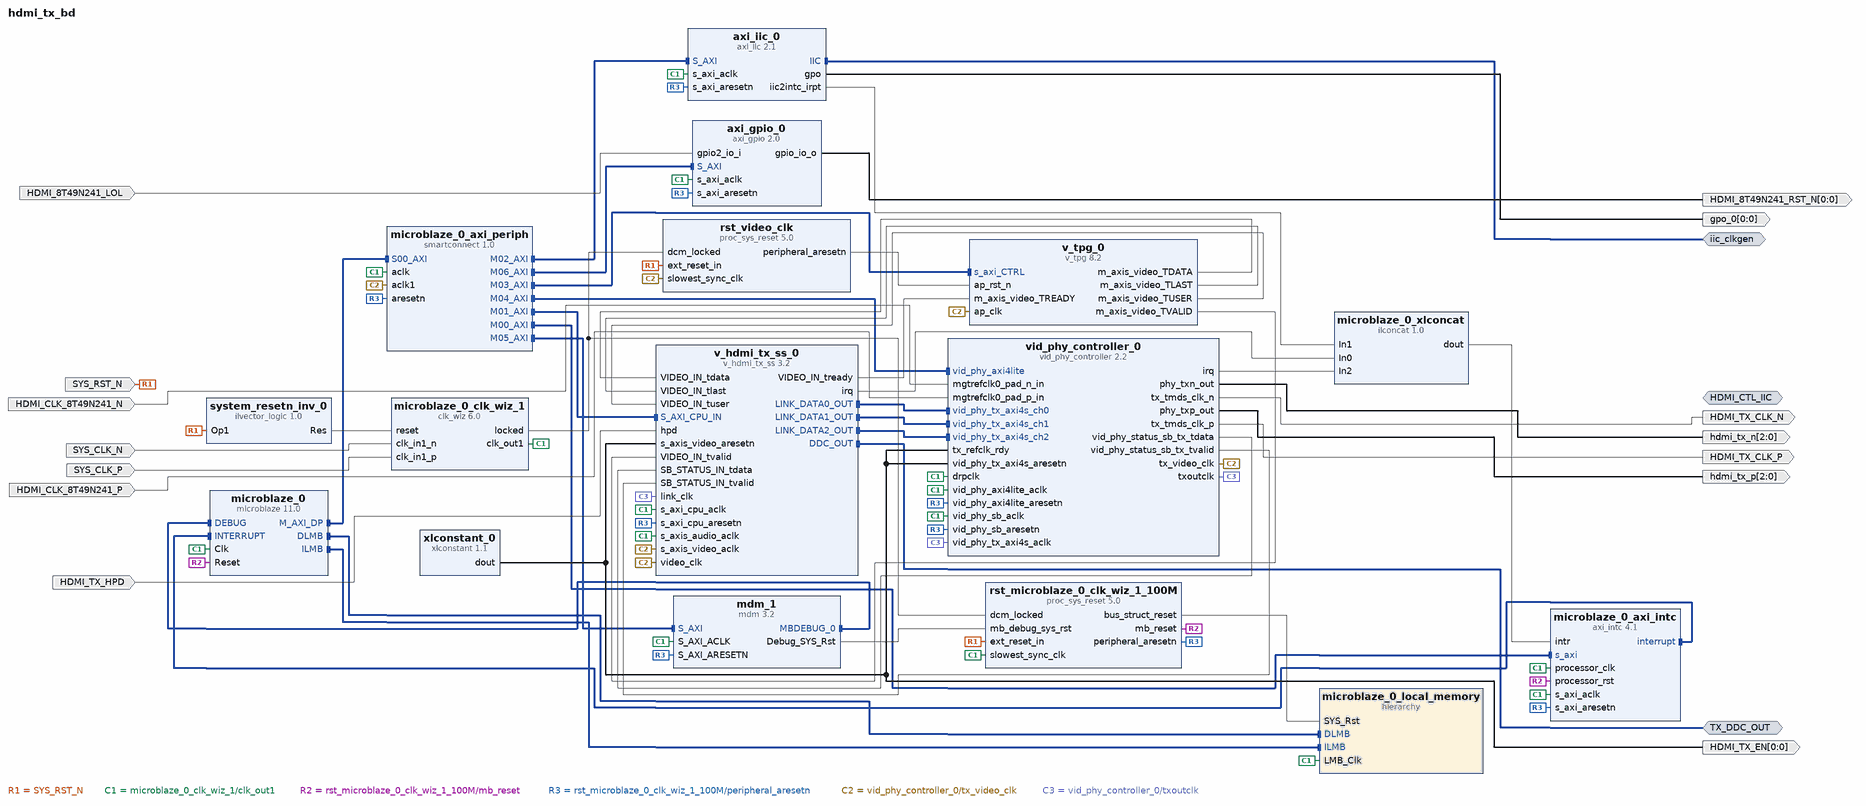
[diagram p0: block diagram of the top level]
# Vivado block design hdmi_tx_bd, xcau15p-ffvb676-2-e, Vivado 2025.2
create_bd_design hdmi_tx_bd

create_bd_intf_port -mode Master -vlnv xilinx.com:interface:iic_rtl:1.0 iic_clkgen
create_bd_intf_port -mode Master -vlnv xilinx.com:interface:iic_rtl:1.0 HDMI_CTL_IIC
create_bd_intf_port -mode Master -vlnv xilinx.com:interface:iic_rtl:1.0 TX_DDC_OUT
create_bd_port -dir I SYS_CLK_N
create_bd_port -dir I SYS_CLK_P
create_bd_port -dir I SYS_RST_N
create_bd_port -dir O -from 0 -to 0 gpo_0
create_bd_port -dir I HDMI_CLK_8T49N241_P
create_bd_port -dir I HDMI_CLK_8T49N241_N
create_bd_port -dir O -from 2 -to 0 hdmi_tx_p
create_bd_port -dir O -from 2 -to 0 hdmi_tx_n
create_bd_port -dir O -from 0 -to 0 HDMI_TX_EN
create_bd_port -dir I HDMI_TX_HPD
create_bd_port -dir O HDMI_TX_CLK_P
create_bd_port -dir O HDMI_TX_CLK_N
create_bd_port -dir O -from 0 -to 0 HDMI_8T49N241_RST_N
create_bd_port -dir I HDMI_8T49N241_LOL

create_bd_cell -type ip -vlnv xilinx.com:ip:v_hdmi_tx_ss:3.2 v_hdmi_tx_ss_0
set_property -dict {CONFIG.C_EXDES_TOPOLOGY 1 CONFIG.C_INPUT_PIXELS_PER_CLOCK 4} [get_bd_cells v_hdmi_tx_ss_0]
create_bd_cell -type ip -vlnv xilinx.com:ip:v_tpg:8.2 v_tpg_0
set_property -dict [list \
  CONFIG.HAS_AXI4S_SLAVE 0 \
  CONFIG.MAX_COLS 1920 \
  CONFIG.MAX_ROWS 1080 \
  CONFIG.SAMPLES_PER_CLOCK 4 \
] [get_bd_cells v_tpg_0]
create_bd_cell -type ip -vlnv xilinx.com:ip:smartconnect:1.0 microblaze_0_axi_periph
set_property -dict {CONFIG.NUM_CLKS 2 CONFIG.NUM_MI 7 CONFIG.NUM_SI 1} [get_bd_cells microblaze_0_axi_periph]
create_bd_cell -type ip -vlnv xilinx.com:ip:axi_intc:4.1 microblaze_0_axi_intc
set_property -dict {CONFIG.C_HAS_FAST 1 CONFIG.C_NUM_SW_INTR 3} [get_bd_cells microblaze_0_axi_intc]
create_bd_cell -type inline_hdl -vlnv xilinx.com:inline_hdl:ilconcat:1.0 microblaze_0_xlconcat
set_property -dict {CONFIG.NUM_PORTS 3} [get_bd_cells microblaze_0_xlconcat]
create_bd_cell -type ip -vlnv xilinx.com:ip:mdm:3.2 mdm_1
set_property -dict {CONFIG.C_ADDR_SIZE 32 CONFIG.C_M_AXI_ADDR_WIDTH 32 CONFIG.C_USE_UART 1} [get_bd_cells mdm_1]
create_bd_cell -type ip -vlnv xilinx.com:ip:clk_wiz:6.0 microblaze_0_clk_wiz_1
set_property -dict [list \
  CONFIG.CLKIN1_JITTER_PS 33.330000000000005 \
  CONFIG.CLKOUT1_JITTER 101.475 \
  CONFIG.CLKOUT1_PHASE_ERROR 77.836 \
  CONFIG.MMCM_CLKFBOUT_MULT_F 4.000 \
  CONFIG.MMCM_CLKIN1_PERIOD 3.333 \
  CONFIG.MMCM_CLKIN2_PERIOD 10.0 \
  CONFIG.PRIM_IN_FREQ 300.000 \
  CONFIG.PRIM_SOURCE Differential_clock_capable_pin \
] [get_bd_cells microblaze_0_clk_wiz_1]
create_bd_cell -type ip -vlnv xilinx.com:ip:proc_sys_reset:5.0 rst_microblaze_0_clk_wiz_1_100M
create_bd_cell -type inline_hdl -vlnv xilinx.com:inline_hdl:ilvector_logic:1.0 system_resetn_inv_0
set_property -dict {CONFIG.C_OPERATION not CONFIG.C_SIZE 1} [get_bd_cells system_resetn_inv_0]
create_bd_cell -type ip -vlnv xilinx.com:ip:axi_iic:2.1 axi_iic_0
create_bd_cell -type ip -vlnv xilinx.com:ip:vid_phy_controller:2.2 vid_phy_controller_0
set_property -dict [list \
  CONFIG.Adv_Clk_Mode false \
  CONFIG.CHANNEL_SITE X0Y8 \
  CONFIG.C_RX_PLL_SELECTION 0 \
  CONFIG.C_RX_REFCLK_SEL 1 \
  CONFIG.C_Rx_Protocol None \
  CONFIG.C_TX_PLL_SELECTION 6 \
  CONFIG.C_TX_REFCLK_SEL 0 \
  CONFIG.C_Tx_Protocol HDMI \
] [get_bd_cells vid_phy_controller_0]
create_bd_cell -type ip -vlnv xilinx.com:ip:proc_sys_reset:5.0 rst_video_clk
create_bd_cell -type ip -vlnv xilinx.com:ip:microblaze:11.0 microblaze_0
set_property -dict [list \
  CONFIG.C_DEBUG_ENABLED 1 \
  CONFIG.C_D_AXI 1 \
  CONFIG.C_D_LMB 1 \
  CONFIG.C_ENABLE_CONVERSION 0 \
  CONFIG.C_I_LMB 1 \
  CONFIG.G_TEMPLATE_LIST 8 \
] [get_bd_cells microblaze_0]
create_bd_cell -type hier microblaze_0_local_memory
create_bd_cell -type ip -vlnv xilinx.com:ip:axi_gpio:2.0 axi_gpio_0
set_property -dict [list \
  CONFIG.C_ALL_INPUTS 0 \
  CONFIG.C_ALL_INPUTS_2 1 \
  CONFIG.C_ALL_OUTPUTS 1 \
  CONFIG.C_GPIO2_WIDTH 1 \
  CONFIG.C_GPIO_WIDTH 1 \
  CONFIG.C_IS_DUAL 1 \
] [get_bd_cells axi_gpio_0]
create_bd_cell -type ip -vlnv xilinx.com:ip:xlconstant:1.1 xlconstant_0

# ---- hierarchy /microblaze_0_local_memory ----
current_bd_instance /microblaze_0_local_memory
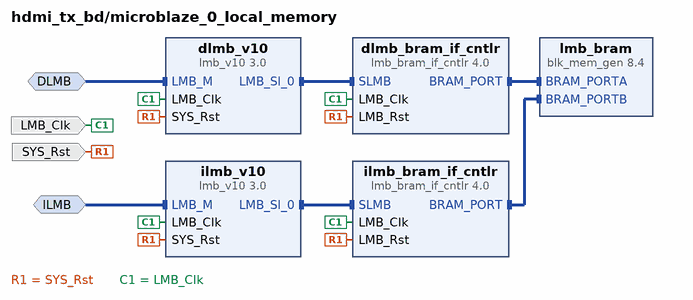
[diagram p1: block diagram inside /microblaze_0_local_memory]
create_bd_intf_pin -mode MirroredMaster -vlnv xilinx.com:interface:lmb_rtl:1.0 DLMB
create_bd_intf_pin -mode MirroredMaster -vlnv xilinx.com:interface:lmb_rtl:1.0 ILMB
create_bd_pin -dir I -type clk LMB_Clk
create_bd_pin -dir I -type rst SYS_Rst

create_bd_cell -type ip -vlnv xilinx.com:ip:lmb_v10:3.0 dlmb_v10
create_bd_cell -type ip -vlnv xilinx.com:ip:lmb_v10:3.0 ilmb_v10
create_bd_cell -type ip -vlnv xilinx.com:ip:lmb_bram_if_cntlr:4.0 dlmb_bram_if_cntlr
set_property -dict {CONFIG.C_ECC 0} [get_bd_cells dlmb_bram_if_cntlr]
create_bd_cell -type ip -vlnv xilinx.com:ip:lmb_bram_if_cntlr:4.0 ilmb_bram_if_cntlr
set_property -dict {CONFIG.C_ECC 0} [get_bd_cells ilmb_bram_if_cntlr]
create_bd_cell -type ip -vlnv xilinx.com:ip:blk_mem_gen:8.4 lmb_bram
set_property -dict {CONFIG.Memory_Type True_Dual_Port_RAM CONFIG.use_bram_block BRAM_Controller} [get_bd_cells lmb_bram]

# ---- connections ----

current_bd_instance /microblaze_0_local_memory
connect_bd_intf_net -intf_net microblaze_0_dlmb [get_bd_intf_pins dlmb_v10/LMB_M] [get_bd_intf_pins DLMB]
connect_bd_intf_net -intf_net microblaze_0_dlmb_bus [get_bd_intf_pins dlmb_v10/LMB_Sl_0] [get_bd_intf_pins dlmb_bram_if_cntlr/SLMB]
connect_bd_intf_net -intf_net microblaze_0_dlmb_cntlr [get_bd_intf_pins dlmb_bram_if_cntlr/BRAM_PORT] [get_bd_intf_pins lmb_bram/BRAM_PORTA]
connect_bd_intf_net -intf_net microblaze_0_ilmb [get_bd_intf_pins ilmb_v10/LMB_M] [get_bd_intf_pins ILMB]
connect_bd_intf_net -intf_net microblaze_0_ilmb_bus [get_bd_intf_pins ilmb_v10/LMB_Sl_0] [get_bd_intf_pins ilmb_bram_if_cntlr/SLMB]
connect_bd_intf_net -intf_net microblaze_0_ilmb_cntlr [get_bd_intf_pins ilmb_bram_if_cntlr/BRAM_PORT] [get_bd_intf_pins lmb_bram/BRAM_PORTB]
connect_bd_net [get_bd_pins SYS_Rst] \
  [get_bd_pins dlmb_v10/SYS_Rst] [get_bd_pins dlmb_bram_if_cntlr/LMB_Rst] [get_bd_pins ilmb_v10/SYS_Rst] \
  [get_bd_pins ilmb_bram_if_cntlr/LMB_Rst]
connect_bd_net -net microblaze_0_Clk [get_bd_pins LMB_Clk] \
  [get_bd_pins dlmb_v10/LMB_Clk] [get_bd_pins dlmb_bram_if_cntlr/LMB_Clk] [get_bd_pins ilmb_v10/LMB_Clk] \
  [get_bd_pins ilmb_bram_if_cntlr/LMB_Clk]
set_property HDL_ATTRIBUTE.BMM_INFO_ADDRESS_SPACE {byte  0x00000000 32 > hdmi_tx_bd microblaze_0_local_memory/lmb_bram} [get_bd_cells dlmb_bram_if_cntlr]
set_property HDL_ATTRIBUTE.KEEP_HIERARCHY yes [get_bd_cells dlmb_bram_if_cntlr]

current_bd_instance /
connect_bd_intf_net [get_bd_intf_ports iic_clkgen] [get_bd_intf_pins axi_iic_0/IIC]
connect_bd_intf_net -intf_net microblaze_0_axi_dp [get_bd_intf_pins microblaze_0_axi_periph/S00_AXI] [get_bd_intf_pins microblaze_0/M_AXI_DP]
connect_bd_intf_net [get_bd_intf_pins microblaze_0_axi_periph/M01_AXI] [get_bd_intf_pins v_hdmi_tx_ss_0/S_AXI_CPU_IN]
connect_bd_intf_net [get_bd_intf_pins microblaze_0_axi_periph/M02_AXI] [get_bd_intf_pins axi_iic_0/S_AXI]
connect_bd_intf_net [get_bd_intf_pins microblaze_0_axi_periph/M03_AXI] [get_bd_intf_pins v_tpg_0/s_axi_CTRL]
connect_bd_intf_net [get_bd_intf_pins microblaze_0_axi_periph/M04_AXI] [get_bd_intf_pins vid_phy_controller_0/vid_phy_axi4lite]
connect_bd_intf_net [get_bd_intf_pins microblaze_0_axi_periph/M05_AXI] [get_bd_intf_pins mdm_1/S_AXI]
connect_bd_intf_net [get_bd_intf_pins microblaze_0_axi_periph/M06_AXI] [get_bd_intf_pins axi_gpio_0/S_AXI]
connect_bd_intf_net [get_bd_intf_pins mdm_1/MBDEBUG_0] [get_bd_intf_pins microblaze_0/DEBUG]
connect_bd_intf_net [get_bd_intf_pins microblaze_0/DLMB] [get_bd_intf_pins microblaze_0_local_memory/DLMB]
connect_bd_intf_net [get_bd_intf_pins microblaze_0/ILMB] [get_bd_intf_pins microblaze_0_local_memory/ILMB]
connect_bd_intf_net -intf_net microblaze_0_intc_axi [get_bd_intf_pins microblaze_0_axi_periph/M00_AXI] [get_bd_intf_pins microblaze_0_axi_intc/s_axi]
connect_bd_intf_net [get_bd_intf_pins microblaze_0_axi_intc/interrupt] [get_bd_intf_pins microblaze_0/INTERRUPT]
connect_bd_intf_net [get_bd_intf_ports TX_DDC_OUT] [get_bd_intf_pins v_hdmi_tx_ss_0/DDC_OUT]
connect_bd_intf_net [get_bd_intf_pins v_hdmi_tx_ss_0/LINK_DATA0_OUT] [get_bd_intf_pins vid_phy_controller_0/vid_phy_tx_axi4s_ch0]
connect_bd_intf_net [get_bd_intf_pins v_hdmi_tx_ss_0/LINK_DATA1_OUT] [get_bd_intf_pins vid_phy_controller_0/vid_phy_tx_axi4s_ch1]
connect_bd_intf_net [get_bd_intf_pins v_hdmi_tx_ss_0/LINK_DATA2_OUT] [get_bd_intf_pins vid_phy_controller_0/vid_phy_tx_axi4s_ch2]
connect_bd_net [get_bd_ports HDMI_8T49N241_LOL] [get_bd_pins axi_gpio_0/gpio2_io_i]
connect_bd_net [get_bd_ports HDMI_CLK_8T49N241_N] [get_bd_pins vid_phy_controller_0/mgtrefclk0_pad_n_in]
connect_bd_net [get_bd_ports HDMI_CLK_8T49N241_P] [get_bd_pins vid_phy_controller_0/mgtrefclk0_pad_p_in]
connect_bd_net [get_bd_ports HDMI_TX_HPD] [get_bd_pins v_hdmi_tx_ss_0/hpd]
connect_bd_net [get_bd_ports SYS_CLK_N] [get_bd_pins microblaze_0_clk_wiz_1/clk_in1_n]
connect_bd_net [get_bd_ports SYS_CLK_P] [get_bd_pins microblaze_0_clk_wiz_1/clk_in1_p]
connect_bd_net [get_bd_ports SYS_RST_N] \
  [get_bd_pins system_resetn_inv_0/Op1] [get_bd_pins rst_video_clk/ext_reset_in] \
  [get_bd_pins rst_microblaze_0_clk_wiz_1_100M/ext_reset_in]
connect_bd_net [get_bd_pins axi_gpio_0/gpio_io_o] [get_bd_ports HDMI_8T49N241_RST_N]
connect_bd_net [get_bd_pins axi_iic_0/gpo] [get_bd_ports gpo_0]
connect_bd_net [get_bd_pins axi_iic_0/iic2intc_irpt] [get_bd_pins microblaze_0_xlconcat/In1]
connect_bd_net [get_bd_pins mdm_1/Debug_SYS_Rst] [get_bd_pins rst_microblaze_0_clk_wiz_1_100M/mb_debug_sys_rst]
connect_bd_net -net microblaze_0_Clk [get_bd_pins microblaze_0_clk_wiz_1/clk_out1] \
  [get_bd_pins vid_phy_controller_0/drpclk] [get_bd_pins vid_phy_controller_0/vid_phy_axi4lite_aclk] \
  [get_bd_pins vid_phy_controller_0/vid_phy_sb_aclk] [get_bd_pins microblaze_0/Clk] \
  [get_bd_pins microblaze_0_axi_periph/aclk] [get_bd_pins microblaze_0_axi_intc/s_axi_aclk] \
  [get_bd_pins microblaze_0_axi_intc/processor_clk] [get_bd_pins microblaze_0_local_memory/LMB_Clk] \
  [get_bd_pins axi_iic_0/s_axi_aclk] [get_bd_pins rst_microblaze_0_clk_wiz_1_100M/slowest_sync_clk] \
  [get_bd_pins v_hdmi_tx_ss_0/s_axi_cpu_aclk] [get_bd_pins v_hdmi_tx_ss_0/s_axis_audio_aclk] [get_bd_pins mdm_1/S_AXI_ACLK] \
  [get_bd_pins axi_gpio_0/s_axi_aclk]
connect_bd_net [get_bd_pins microblaze_0_clk_wiz_1/locked] \
  [get_bd_pins rst_video_clk/dcm_locked] [get_bd_pins rst_microblaze_0_clk_wiz_1_100M/dcm_locked]
connect_bd_net -net microblaze_0_intr [get_bd_pins microblaze_0_xlconcat/dout] [get_bd_pins microblaze_0_axi_intc/intr]
connect_bd_net [get_bd_pins rst_microblaze_0_clk_wiz_1_100M/bus_struct_reset] [get_bd_pins microblaze_0_local_memory/SYS_Rst]
connect_bd_net [get_bd_pins rst_microblaze_0_clk_wiz_1_100M/mb_reset] \
  [get_bd_pins microblaze_0_axi_intc/processor_rst] [get_bd_pins microblaze_0/Reset]
connect_bd_net [get_bd_pins rst_microblaze_0_clk_wiz_1_100M/peripheral_aresetn] \
  [get_bd_pins microblaze_0_axi_periph/aresetn] [get_bd_pins microblaze_0_axi_intc/s_axi_aresetn] \
  [get_bd_pins vid_phy_controller_0/vid_phy_axi4lite_aresetn] [get_bd_pins axi_iic_0/s_axi_aresetn] \
  [get_bd_pins v_hdmi_tx_ss_0/s_axi_cpu_aresetn] [get_bd_pins mdm_1/S_AXI_ARESETN] [get_bd_pins axi_gpio_0/s_axi_aresetn] \
  [get_bd_pins vid_phy_controller_0/vid_phy_sb_aresetn]
connect_bd_net [get_bd_pins rst_video_clk/peripheral_aresetn] [get_bd_pins v_tpg_0/ap_rst_n]
connect_bd_net [get_bd_pins system_resetn_inv_0/Res] [get_bd_pins microblaze_0_clk_wiz_1/reset]
connect_bd_net [get_bd_pins v_hdmi_tx_ss_0/VIDEO_IN_tready] [get_bd_pins v_tpg_0/m_axis_video_TREADY]
connect_bd_net [get_bd_pins v_hdmi_tx_ss_0/irq] [get_bd_pins microblaze_0_xlconcat/In0]
connect_bd_net [get_bd_pins v_tpg_0/m_axis_video_TDATA] [get_bd_pins v_hdmi_tx_ss_0/VIDEO_IN_tdata]
connect_bd_net [get_bd_pins v_tpg_0/m_axis_video_TLAST] [get_bd_pins v_hdmi_tx_ss_0/VIDEO_IN_tlast]
connect_bd_net [get_bd_pins v_tpg_0/m_axis_video_TUSER] [get_bd_pins v_hdmi_tx_ss_0/VIDEO_IN_tuser]
connect_bd_net [get_bd_pins v_tpg_0/m_axis_video_TVALID] [get_bd_pins v_hdmi_tx_ss_0/VIDEO_IN_tvalid]
connect_bd_net [get_bd_pins vid_phy_controller_0/irq] [get_bd_pins microblaze_0_xlconcat/In2]
connect_bd_net [get_bd_pins vid_phy_controller_0/phy_txn_out] [get_bd_ports hdmi_tx_n]
connect_bd_net [get_bd_pins vid_phy_controller_0/phy_txp_out] [get_bd_ports hdmi_tx_p]
connect_bd_net [get_bd_pins vid_phy_controller_0/tx_tmds_clk_n] [get_bd_ports HDMI_TX_CLK_N]
connect_bd_net [get_bd_pins vid_phy_controller_0/tx_tmds_clk_p] [get_bd_ports HDMI_TX_CLK_P]
connect_bd_net [get_bd_pins vid_phy_controller_0/tx_video_clk] \
  [get_bd_pins v_tpg_0/ap_clk] [get_bd_pins microblaze_0_axi_periph/aclk1] [get_bd_pins rst_video_clk/slowest_sync_clk] \
  [get_bd_pins v_hdmi_tx_ss_0/video_clk] [get_bd_pins v_hdmi_tx_ss_0/s_axis_video_aclk]
connect_bd_net [get_bd_pins vid_phy_controller_0/txoutclk] \
  [get_bd_pins vid_phy_controller_0/vid_phy_tx_axi4s_aclk] [get_bd_pins v_hdmi_tx_ss_0/link_clk]
connect_bd_net [get_bd_pins vid_phy_controller_0/vid_phy_status_sb_tx_tdata] [get_bd_pins v_hdmi_tx_ss_0/SB_STATUS_IN_tdata]
connect_bd_net [get_bd_pins vid_phy_controller_0/vid_phy_status_sb_tx_tvalid] [get_bd_pins v_hdmi_tx_ss_0/SB_STATUS_IN_tvalid]
connect_bd_net [get_bd_pins xlconstant_0/dout] \
  [get_bd_ports HDMI_TX_EN] [get_bd_pins v_hdmi_tx_ss_0/s_axis_video_aresetn] \
  [get_bd_pins vid_phy_controller_0/tx_refclk_rdy] [get_bd_pins vid_phy_controller_0/vid_phy_tx_axi4s_aresetn]
set_property HDL_ATTRIBUTE.BMM_INFO_PROCESSOR {microblaze-le > hdmi_tx_bd microblaze_0_local_memory/dlmb_bram_if_cntlr} [get_bd_cells microblaze_0]
set_property HDL_ATTRIBUTE.KEEP_HIERARCHY yes [get_bd_cells microblaze_0]

# ---- address map ----
assign_bd_address -offset 0x00000000 -range 384K -target_address_space [get_bd_addr_spaces microblaze_0/Data] [get_bd_addr_segs microblaze_0_local_memory/dlmb_bram_if_cntlr/SLMB/Mem]
assign_bd_address -offset 0x40000000 -range 64K -target_address_space [get_bd_addr_spaces microblaze_0/Data] [get_bd_addr_segs axi_gpio_0/S_AXI/Reg]
assign_bd_address -offset 0x40800000 -range 64K -target_address_space [get_bd_addr_spaces microblaze_0/Data] [get_bd_addr_segs axi_iic_0/S_AXI/Reg]
assign_bd_address -offset 0x41200000 -range 64K -target_address_space [get_bd_addr_spaces microblaze_0/Data] [get_bd_addr_segs microblaze_0_axi_intc/S_AXI/Reg]
assign_bd_address -offset 0x41400000 -range 4K -target_address_space [get_bd_addr_spaces microblaze_0/Data] [get_bd_addr_segs mdm_1/S_AXI/Reg]
assign_bd_address -offset 0x44A00000 -range 128K -target_address_space [get_bd_addr_spaces microblaze_0/Data] [get_bd_addr_segs v_hdmi_tx_ss_0/S_AXI_CPU_IN/Reg]
assign_bd_address -offset 0x44A20000 -range 64K -target_address_space [get_bd_addr_spaces microblaze_0/Data] [get_bd_addr_segs v_tpg_0/s_axi_CTRL/Reg]
assign_bd_address -offset 0x44A30000 -range 64K -target_address_space [get_bd_addr_spaces microblaze_0/Data] [get_bd_addr_segs vid_phy_controller_0/vid_phy_axi4lite/Reg]
assign_bd_address -offset 0x00000000 -range 384K -target_address_space [get_bd_addr_spaces microblaze_0/Instruction] [get_bd_addr_segs microblaze_0_local_memory/ilmb_bram_if_cntlr/SLMB/Mem]

validate_bd_design
save_bd_design
